# Altium schematic sheet Motion_Sensor.SchDoc
size A2
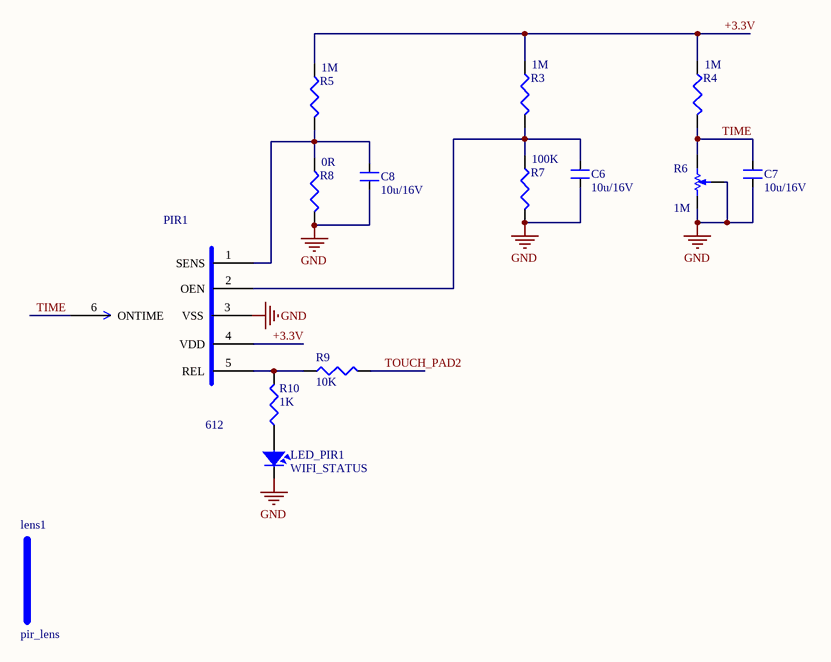
[diagram p0: Motion_Sensor.SchDoc]

## Parts
C6  10u/16V  [SM-0805]
C7  10u/16V  [SM-0805]
C8  10u/16V  [SM-0805]
LED_PIR1  WIFI_STATUS  [R0603]
lens1  pir_lens  [PCBComponent_1]
PIR1  612  [TO5]
R3  1M  [J1-0603]
R4  1M  [J1-0603]
R5  1M  [J1-0603]
R6  1M  [POT4MM-2]
R7  100K  [J1-0603]
R8  0R  [J1-0603]
R9  10K  [J1-0603]
R10  1K  [J1-0603]

## Nets
GND: C6.2 C7.2 C8.2 LED_PIR1.2 PIR1.3(VSS) R6.CCW(-) R6.W R7.2 R8.2
+3.3V: PIR1.4(VDD) R3.1 R4.1 R5.1
TIME: C7.1 PIR1.6(ONTIME) R4.2 R6.CW(+)
TOUCH_PAD2: R9.2
NetC6_1: C6.1 PIR1.2(OEN) R3.2 R7.1
NetC8_1: C8.1 PIR1.1(SENS) R5.2 R8.1
NetLED_PIR1_1: LED_PIR1.1 R10.1
NetPIR1_5: PIR1.5(REL) R9.1 R10.2

## Library data of the parts
C6-C8 = CM: Cap SMD; Value: 103
LED_PIR1 = LED: LED Single colour Green and Red; Value: LED 3 ly Single Colour
PIR1 = PIR_612
R3-R5 R7-R9 = Res3: Resistor; Value: 1K; Published: 8-Jun-2000; LatestRevisionDate: 29-May-2009; LatestRevisionNote: IPC-7351 Footprint Added.; PackageReference: J1-0603; Publisher: Altium Limited; PackageDescription: Chip Resistor
R6 = RPot SM: Square Trimming Potentiometer; Published: 17-Dec-2003; DatasheetVersion: Oct-2003; PackageReference: POT4MM-2; Publisher: Altium Limited; PackageDescription: Square Trimming Potentiometer; ComponentLink1Description: Manufacturer Link; ComponentLink1URL: http://bourns.com/2/search.html
R10 = Res3: Resistor; Published: 8-Jun-2000; LatestRevisionDate: 29-May-2009; LatestRevisionNote: IPC-7351 Footprint Added.; PackageReference: J1-0603; Publisher: Altium Limited; PackageDescription: Chip Resistor; Value: 1K